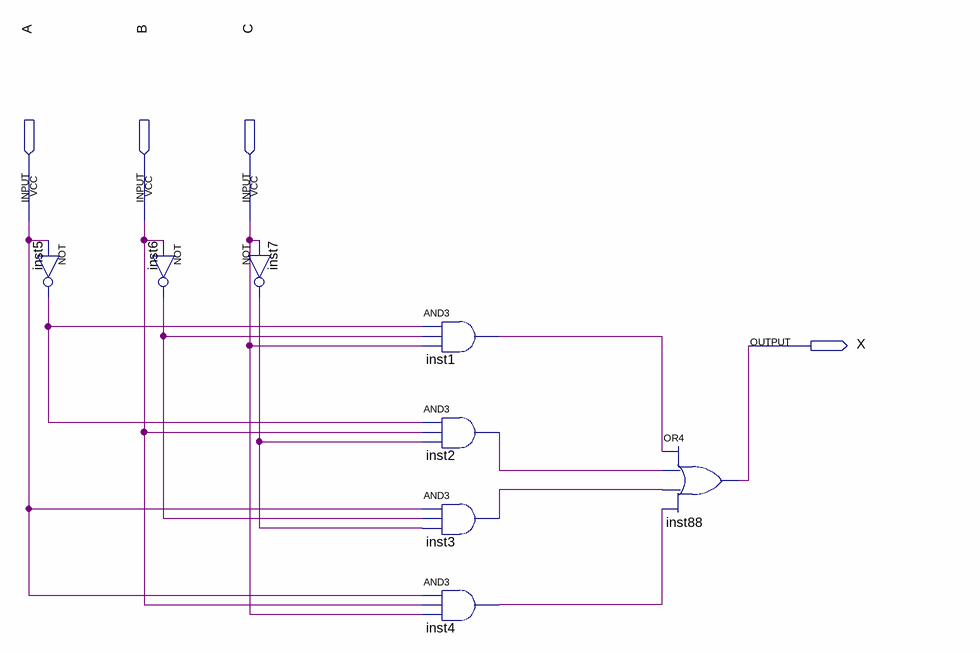
[diagram p0: schematic sheet]
// Quartus schematic Lab1.bdf as structural Verilog: 8 symbols, 4 pins
module Lab1 (
  input  A,
  input  B,
  input  C,
  output X
);

  wire inst1_out, inst2_out, inst3_out, inst4_out, inst5_out, inst6_out, inst7_out;

  not inst5 (inst5_out, A);
  not inst6 (inst6_out, B);
  not inst7 (inst7_out, C);
  and inst1 (inst1_out, inst5_out, inst6_out, C);
  and inst2 (inst2_out, inst5_out, B, inst7_out);
  and inst3 (inst3_out, A, inst6_out, inst7_out);
  and inst4 (inst4_out, A, B, C);
  or inst88 (X, inst1_out, inst2_out, inst3_out, inst4_out);
endmodule
